# Altium schematic sheet Off-Board Connections.SchDoc
size A
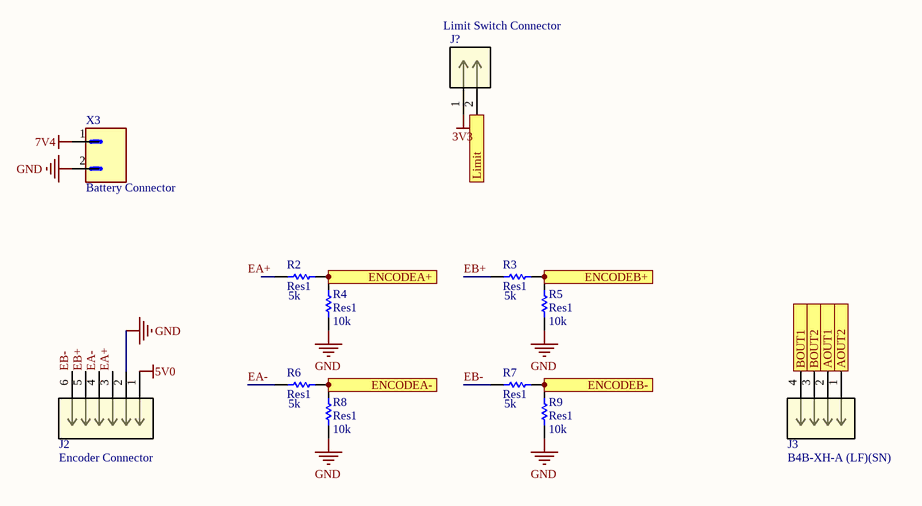
[diagram p0: Off-Board Connections.SchDoc]

## Parts
J2  Encoder Connector  [CONN_B6B-XH-A(LF)(SN)_JST]
J3  B4B-XH-A (LF)(SN)  [CONN_B4B-XH-A (LF)(SN)_JST]
J?  Limit Switch Connector  [CONN_B2B-EH-A (LF)(SN)_JST]
R2  Res1  value 5k  [0402-A]
R3  Res1  value 5k  [0402-A]
R4  Res1  value 10k  [0402-A]
R5  Res1  value 10k  [0402-A]
R6  Res1  value 5k  [0402-A]
R7  Res1  value 5k  [0402-A]
R8  Res1  value 10k  [0402-A]
R9  Res1  value 10k  [0402-A]
X3  Battery Connector  [B2P-VH]

## Ports
AOUT1 (in), AOUT2 (in), BOUT1 (in), BOUT2 (in), ENCODEA+ (out), ENCODEA- (out), ENCODEB+ (out), ENCODEB- (out), Limit (out)

## Nets
3V3: J?.1
5V0: J2.1
7V4: X3.1
GND: J2.2 R4.2 R5.2 R8.2 R9.2 X3.2
AOUT1: J3.2 ; port AOUT1
AOUT2: J3.1 ; port AOUT2
BOUT1: J3.4 ; port BOUT1
BOUT2: J3.3 ; port BOUT2
EA+: J2.3
EA-: J2.4 R6.2
EB+: J2.5 R3.2
EB-: J2.6 R7.2
ENCODEA+: R2.1 R4.1 ; port ENCODEA+
ENCODEA-: R6.1 R8.1 ; port ENCODEA-
ENCODEB+: R3.1 R5.1 ; port ENCODEB+
ENCODEB-: R7.1 R9.1 ; port ENCODEB-
Limit: J?.2 ; port Limit

Not connected (* = marked no-connect by the designer): R2 2

## Notes on the sheet
- Labels drawn without touching a wire or pin: EA+

## Library data of the parts
J2 = B6B-XH-A(LF)(SN): No Description Available; Vendor: JST; Built_By: EMA_Cory; SourceLibrary: JST_2019-12-02; Manufacturer_Part_Number: B6B-XH-A(LF)(SN); Copyright: Copyright (C) 2018 Accelerated Designs. All rights reserved; RefDes: RefDes; Type: DEV
J3 = B4B-XH-A (LF)(SN): No Description Available; Vendor: JST; Built_By: EMA_Cory; SourceLibrary: JST_2020-02-03; Datasheet: http://www.jst-mfg.com/product/pdf/eng/eXH.pdf; Manufacturer_Part_Number: B4B-XH-A (LF)(SN); Copyright: Copyright (C) 2018 Accelerated Designs. All rights reserved; RefDes: RefDes; Type: DEV
J? = B2B-EH-A (LF)(SN): No Description Available; Vendor: JST; Built_By: EMA_TJ; SourceLibrary: JST_2019-01-31; Copyright: Copyright (C) 2018 Accelerated Designs. All rights reserved; Manufacturer_Part_Number: B2B-EH-A (LF)(SN); RefDes: RefDes; Type: DEV
R2-R9 = Res1: Resistor; Published: 8-Jun-2000; LatestRevisionDate: 17-Jul-2002; LatestRevisionNote: Re-released for DXP Platform.; PackageReference: AXIAL-0.3; Publisher: Altium Limited; PackageDescription: Axial Device, Thru-Hole; 2 Leads; 0.3 in Pin Spacing
X3 = B2P-VH(LF)(SN): Connector Header Through Hole 2 position 0.156 _3.96mm_; MP: B2P-VH_LF__SN_; MF: JST Sales; Value: *; Package: None; Price: None; Availability: Unavailable; SnapEDA_Link: https://www.snapeda.com/parts/B2P-VH%28LF%29%28SN%29/JST%20Sales%20America%20Inc./view-part/104373/?ref=snap